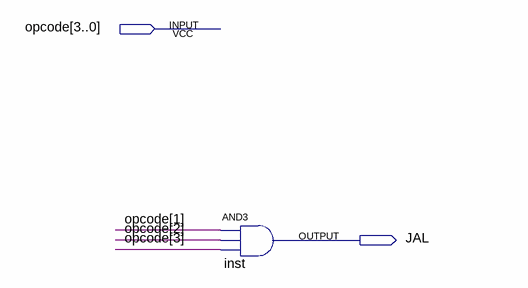
[diagram p0: schematic sheet]
// Quartus schematic JAL.bdf as structural Verilog: 1 symbols, 2 pins
module JAL (
  input  [3:0] opcode,
  output JAL
);

  and inst (JAL, opcode[1], opcode[2], opcode[3]);
endmodule
